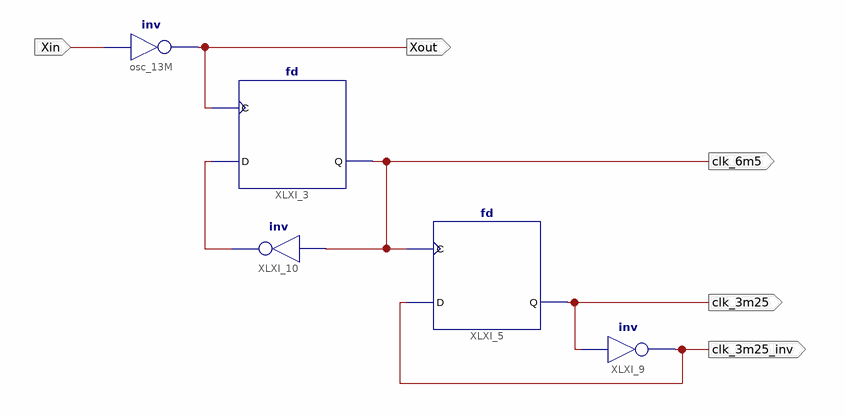
[diagram p0: schematic sheet 1]
// Xilinx ISE schematic clock_gen.sch (xc9500) as structural Verilog: 5 symbols, 5 ports
module clock_gen (
  input  Xin,
  output Xout,
  output clk_6m5,
  output clk_3m25,
  output clk_3m25_inv
);

  wire XLXN_20;

  not osc_13M (Xout, Xin);
  fd XLXI_3 (.C(Xout), .D(XLXN_20), .Q(clk_6m5));
  fd XLXI_5 (.C(clk_6m5), .D(clk_3m25_inv), .Q(clk_3m25));
  not XLXI_9 (clk_3m25_inv, clk_3m25);
  not XLXI_10 (XLXN_20, clk_6m5);
endmodule
